# EAGLE design integrated (EAGLE 7.4.0)
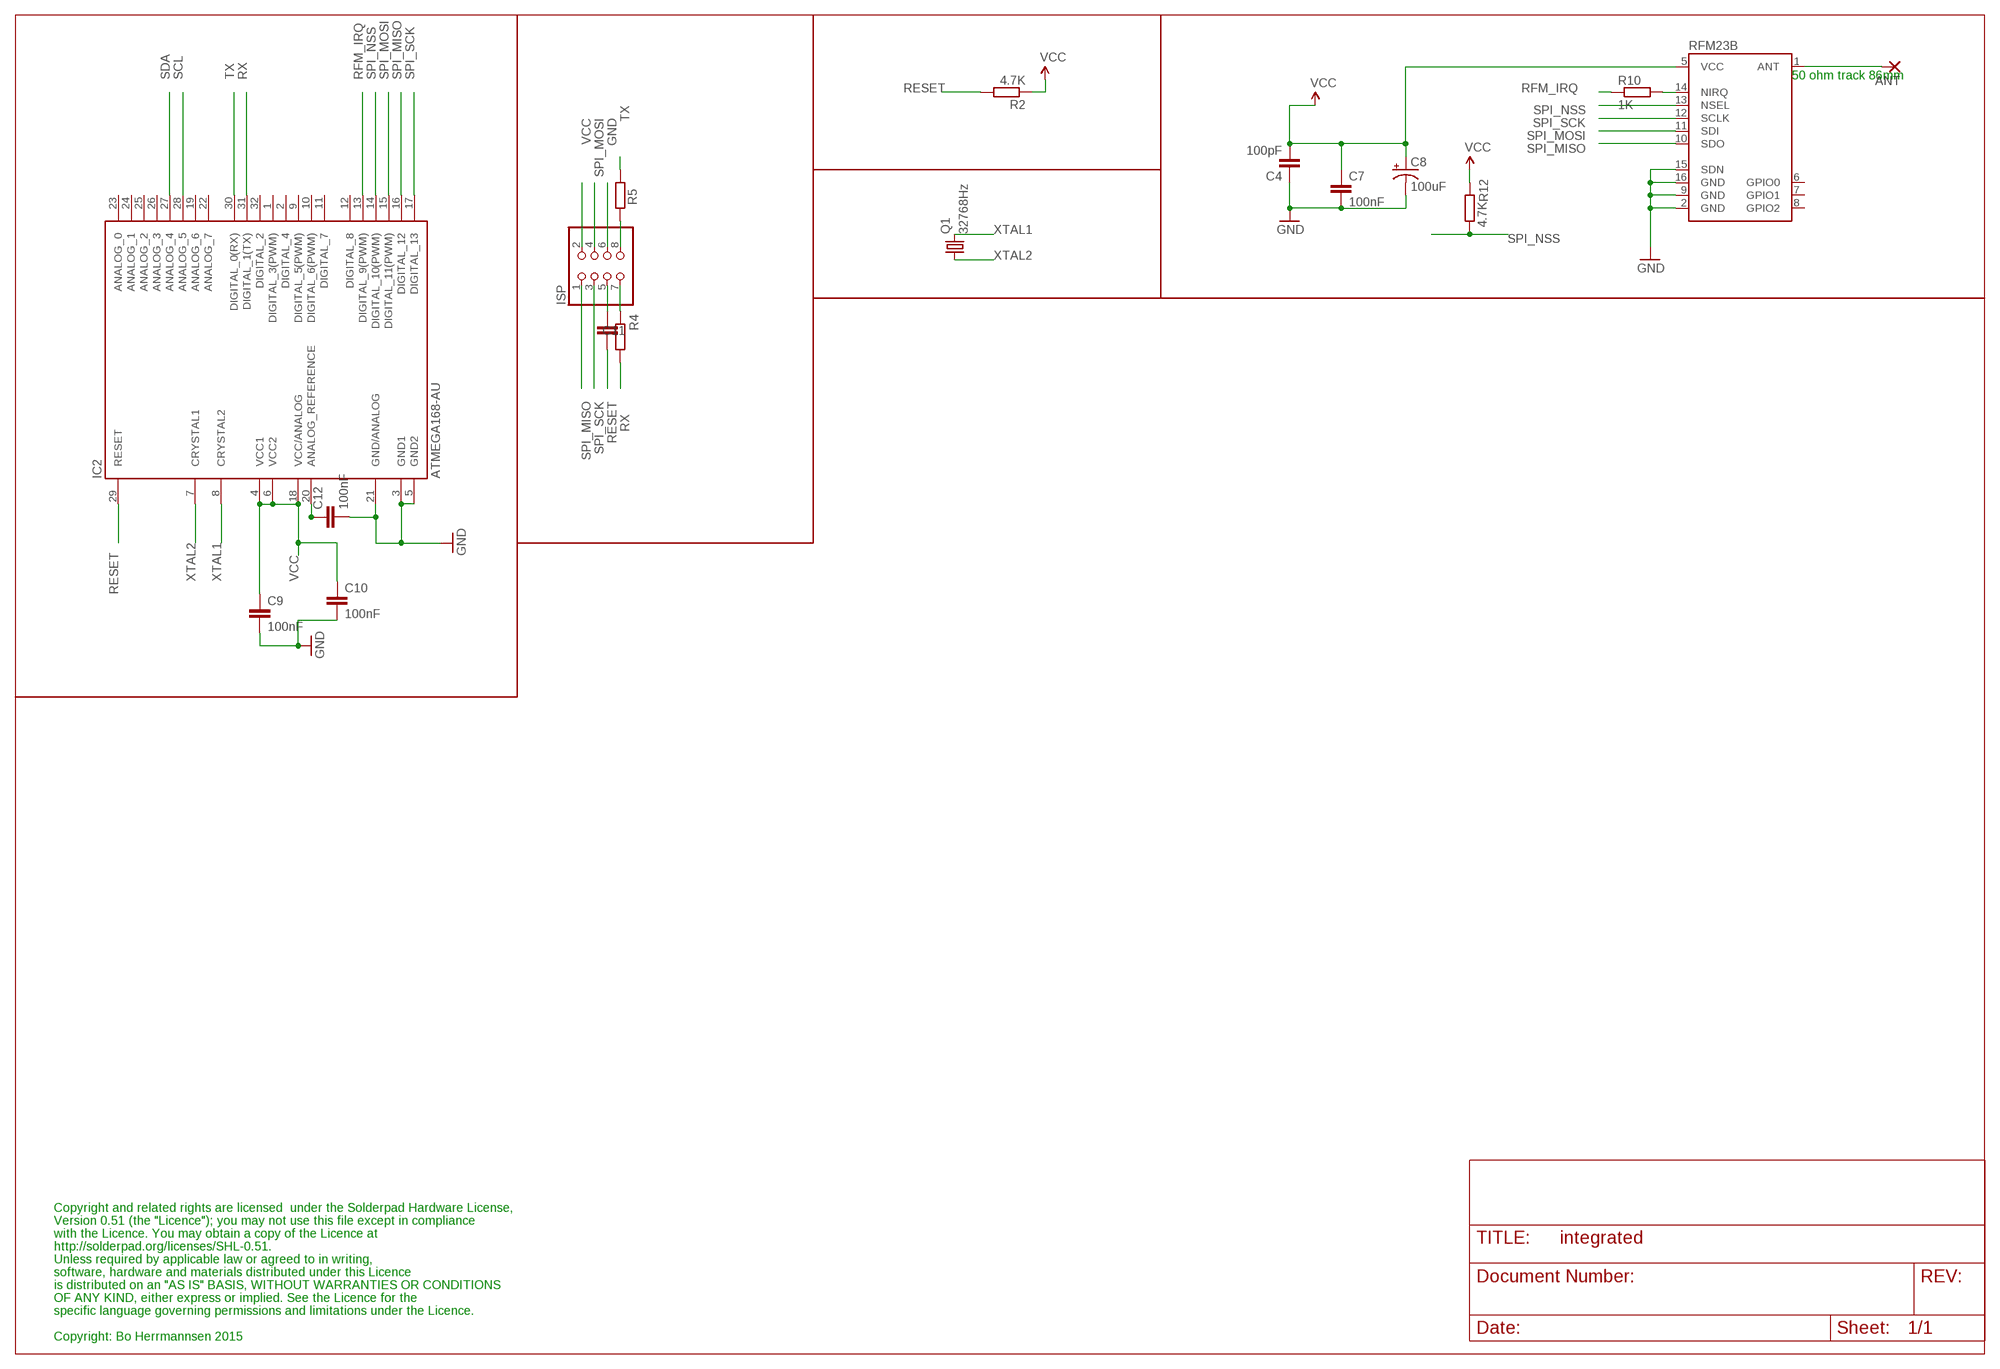
[diagram p0: schematic, sheet 1]

## Parts
ANT  2,15/1,0  [2,15/1,0]
C4  100pF  C-EUC0603  [C0603]
C7  100nF  C-EUC0603  [C0603]
C8  100uF  CAP_POL1206  [EIA3216]
C9  100nF  C-EUC0603  [C0603]
C10  100nF  C-EUC0603  [C0603]
C11  100nF  C-EUC0603  [C0603]
C12  100nF  C-EUC0603  [C0603]
IC2  ATMEGA168-AU  [TQFP32-08]
ISP  PINHD-2X4/90  [2X04/90]
Q1  32768Hz  MC-306  [MC-306]
R2  4.7K  R-EU_R0603  [R0603]
R4  4.7K  R-EU_R0603  [R0603]
R5  4.7K  R-EU_R0603  [R0603]
R10  1K  R-EU_R0603  [R0603]
R12  4.7K  R-EU_R0603  [R0603]
RFM23B  RFM23B  [RFM23-XXX-S1]

## Nets
GND [supply]: C4.1 C7.2 C8.C(-) C9.2 C10.2 C12.2 IC2.3(GND1) IC2.5(GND2) IC2.21(GND/ANALOG) ISP.6 RFM23B.2(GND) RFM23B.9(GND) RFM23B.15(SDN) RFM23B.16(GND)
N$1: C11.2 ISP.5
N$3: ISP.8 R5.2
N$4: ISP.7 R4.2
N$6 [supply]: C12.1 IC2.20(ANALOG_REFERENCE)
N$7: R10.2 RFM23B.14(NIRQ)
N$31 [ant]: ANT.1(P) RFM23B.1(ANT)
RESET: C11.1 IC2.29(RESET) R2.2
RFM_IRQ: IC2.13(DIGITAL_9(PWM)) R10.1
RX: IC2.31(DIGITAL_1(TX)) R4.1
SCL: IC2.28(ANALOG_5)
SDA: IC2.27(ANALOG_4)
SPI_MISO: IC2.16(DIGITAL_12) ISP.1 RFM23B.10(SDO)
SPI_MOSI: IC2.15(DIGITAL_11(PWM)) ISP.4 RFM23B.11(SDI)
SPI_NSS: IC2.14(DIGITAL_10(PWM)) R12.1 RFM23B.13(NSEL)
SPI_SCK: IC2.17(DIGITAL_13) ISP.3 RFM23B.12(SCLK)
TX: IC2.30(DIGITAL_0(RX)) R5.1
VCC [supply]: C4.2 C7.1 C8.A(+) C9.1 C10.1 IC2.4(VCC1) IC2.6(VCC2) IC2.18(VCC/ANALOG) ISP.2 R2.1 R12.2 RFM23B.5(VCC)
XTAL1: IC2.8(CRYSTAL2) Q1.4
XTAL2: IC2.7(CRYSTAL1) Q1.1
Unconnected: IC2.1(DIGITAL_3(PWM)) IC2.2(DIGITAL_4) IC2.9(DIGITAL_5(PWM)) IC2.10(DIGITAL_6(PWM)) IC2.11(DIGITAL_7) IC2.12(DIGITAL_8) IC2.19(ANALOG_6) IC2.22(ANALOG_7) IC2.23(ANALOG_0) IC2.24(ANALOG_1) IC2.25(ANALOG_2) IC2.26(ANALOG_3) IC2.32(DIGITAL_2) RFM23B.6(GPIO0) RFM23B.7(GPIO1) RFM23B.8(GPIO2)

## Notes on the sheet
- 50 ohm track 86mm
- Copyright and related rights are licensed  under the Solderpad Hardware License,
- Version 0.51 (the "Licence"); you may not use this file except in compliance
- with the Licence. You may obtain a copy of the Licence at
- http://solderpad.org/licenses/SHL-0.51.
- Unless required by applicable law or agreed to in writing,
- software, hardware and materials distributed under this Licence
- is distributed on an "AS IS" BASIS, WITHOUT WARRANTIES OR CONDITIONS
- OF ANY KIND, either express or implied. See the Licence for the
- specific language governing permissions and limitations under the Licence.
- Copyright: Bo Herrmannsen 2015

## Library data of the parts
ANT = wirepad:2,15/1,0: THROUGH-HOLE PAD
C4 C7 C9-C12 = resistor:C-EU: CAPACITOR, European symbol
C8 = SparkFun-Passives:CAP_POL: Capacitor Polarized These are standard SMD and PTH capacitors. Normally 10uF, 47uF, and 100uF in electrolytic and tantalum varieties. Always verify the external diameter of the through hole cap, it varies with capacity, voltage, and manufacturer. The EIA devices should be standard.
IC2 = Arduino-AVR:ATMEGA168
ISP = pinhead:PINHD-2X4: PIN HEADER
Q1 = crystal:MC-306: kHz RANGE CRYSTAL UNIT SMD Source: MC-306_405_406_E07X.PDF Homepage <http://www.epsontoyocom.co.jp>; MPN: MC-306 60.0KHZ 100PPM ,12.5PF; OC_FARNELL: 1278040; OC_NEWARK: 31M5576
R2 R4 R5 R10 R12 = resistor:R-EU_: RESISTOR, European symbol
RFM23B = SparkFun-RF:RFM23B

## Net classes
0 default: width 0.203 mm
1 supply: width 0.5 mm, clearance 0.203 mm
2 ant: width 2.184 mm

## Board
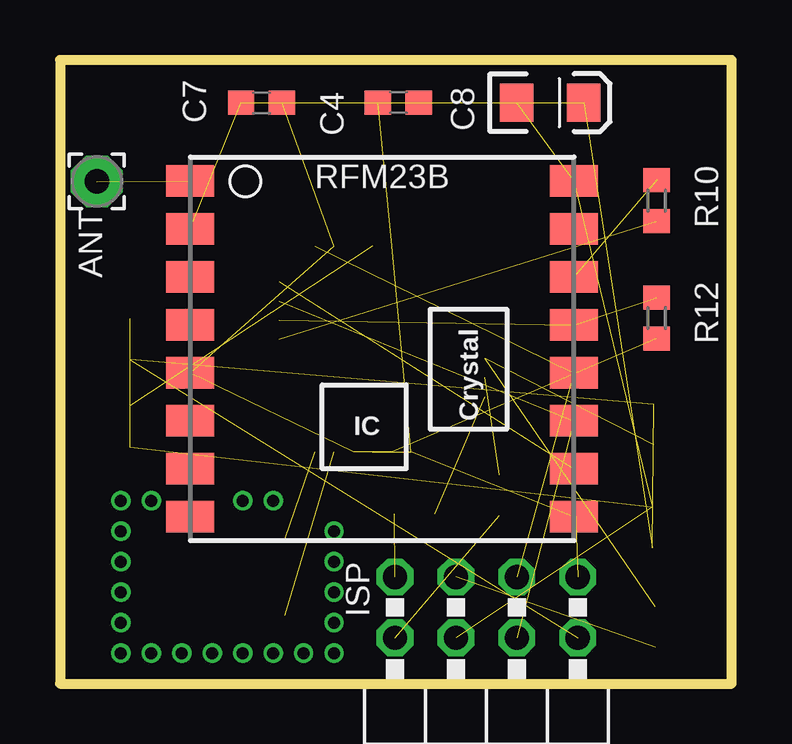
[diagram p1: board, top side]
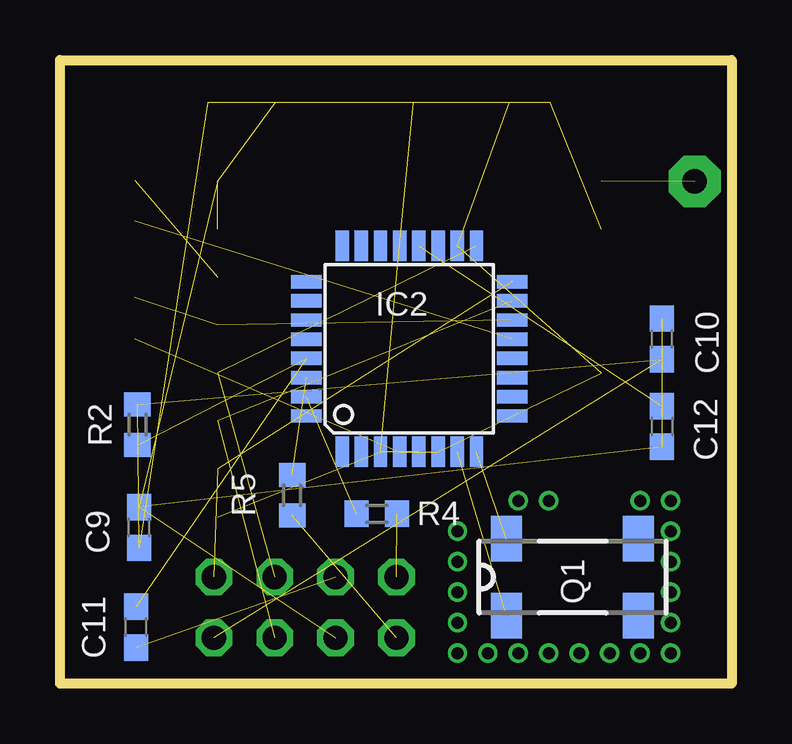
[diagram p2: board, bottom side, seen from below]

Size 28 x 26 mm. Coordinates in mm from the lower left corner, seen from the top.
Outline: 0,26 0,0 28,0 28,26 0,26
Copper layers (1*16): Top 0.035mm / dielectric 1.5mm / Bottom 0.035mm
Design rules "PMServicesStd *": minimum track width 8mil, minimum drill 0.5mm, track to track 8mil, track to pad 8mil, pad to pad 8mil, via to via 8mil, smd to smd 0mil, copper to edge 10mil, drill to drill 10mil, minimum pad ring 10mil, minimum via ring 6mil, stop-mask expansion 2mil, vias tented up to drill 100mil, thermal gap 10mil
tRestrict: area 2.5,1.3 to 7.6,7.6
bRestrict: area 2.5,1.3 to 7.6,7.6

### Footprints (pad centres in the part's own frame; a part is rotated, then mirrored left to right if it is on the bottom)
2,15/1,0 = drill 1.016 pad 2.159 octagon: 1 0,0
C0603 = smd 1.1 x 1: 1 -0.85,0; 2 0.85,0
EIA3216 = smd 1.4 x 1.6: A 1.4,0; C -1.4,0
TQFP32-08 = smd 1.27 x 0.559: 1 -4.293,2.8; 2 -4.293,2; 3 -4.293,1.2; 4 -4.293,0.4; 5 -4.293,-0.4; 6 -4.293,-1.2; 7 -4.293,-2; 8 -4.293,-2.8; 17 4.293,-2.8; 18 4.293,-2; 19 4.293,-1.2; 20 4.293,-0.4; 21 4.293,0.4; 22 4.293,1.2; 23 4.293,2; 24 4.293,2.8 | smd 0.559 x 1.27: 9 -2.8,-4.293; 10 -2,-4.293; 11 -1.2,-4.293; 12 -0.4,-4.293; 13 0.4,-4.293; 14 1.2,-4.293; 15 2,-4.293; 16 2.8,-4.293; 25 2.8,4.293; 26 2,4.293; 27 1.2,4.293; 28 0.4,4.293; 29 -0.4,4.293; 30 -1.2,4.293; 31 -2,4.293; 32 -2.8,4.293
2X04/90 = drill 1.016 octagon: 1 -3.81,-6.35; 2 -3.81,-3.81; 3 -1.27,-6.35; 4 -1.27,-3.81; 5 1.27,-6.35; 6 1.27,-3.81; 7 3.81,-6.35; 8 3.81,-3.81
MC-306 = smd 1.3 x 1.9: 1 -2.75,-1.6; 2 2.75,-1.6; 3 2.75,1.6; 4 -2.75,1.6
R0603 = smd 1 x 1.1: 1 -0.85,0; 2 0.85,0
RFM23-XXX-S1 = smd 2 x 1.3: 1 -8,7; 2 -8,5; 3 -8,3; 4 -8,1; 5 -8,-1; 6 -8,-3; 7 -8,-5; 8 -8,-7; 9 8,-7; 10 8,-5; 11 8,-3; 12 8,-1; 13 8,1; 14 8,3; 15 8,5; 16 8,7

### Placement (x,y rotation side)
ANT  1.53,20.93 90 top
C4  14.11,24.22 0 top
C7  8.4,24.22 180 top
C8  20.44,24.22 0 top
C9  24.7,6.51 90 bottom
C10  2.9,14.37 90 bottom
C11  24.83,2.35 270 bottom
C12  2.9,10.72 270 bottom
IC2  13.44,13.96 90 bottom
ISP  17.78,-1.91 180 top
Q1  6.63,4.44 0 bottom
R2  24.77,10.79 270 bottom
R4  14.79,7.08 0 bottom
R5  18.32,7.85 270 bottom
R10  24.88,20.13 90 top
R12  24.88,15.24 270 top
RFM23B  13.44,13.96 0 top

### Tracks (layer width: path | path; a pad name or v marks a point on that pad's centre or on a via)
GND  (13 unrouted)
N$1  (1 unrouted)
N$3  (1 unrouted)
N$4  (1 unrouted)
N$6  (1 unrouted)
N$7  (1 unrouted)
N$11  (via drill 0.5)
  other vias: 2.54,6.35
N$12  (via drill 0.5)
  other vias: 2.54,5.08
N$14  (via drill 0.5)
  other vias: 2.54,3.81
N$15  (via drill 0.5)
  other vias: 2.54,2.54
N$16  (via drill 0.5)
  other vias: 2.54,1.27
N$17  (via drill 0.5)
  other vias: 3.81,1.27
N$19  (via drill 0.5)
  other vias: 5.08,1.27
N$20  (via drill 0.5)
  other vias: 6.35,1.27
N$21  (via drill 0.5)
  other vias: 7.62,1.27
N$22  (via drill 0.5)
  other vias: 8.89,1.27
N$24  (via drill 0.5)
  other vias: 11.43,5.08
N$25  (via drill 0.5)
  other vias: 11.43,1.27
N$26  (via drill 0.5)
  other vias: 11.43,2.54 10.16,1.27
N$30  (via drill 0.5)
  other vias: 11.43,3.81
N$31  (1 unrouted)
N$33  (via drill 0.5)
  other vias: 8.89,7.62
N$34  (via drill 0.5)
  other vias: 7.62,7.62
N$37  (via drill 0.5)
  other vias: 3.81,7.62
N$38  (via drill 0.5)
  other vias: 2.54,7.62
N$39  (via drill 0.5)
  other vias: 11.43,6.35
RESET  (2 unrouted)
RFM_IRQ  (1 unrouted)
RX  (1 unrouted)
SPI_MISO  (2 unrouted)
SPI_MOSI  (2 unrouted)
SPI_NSS  (2 unrouted)
SPI_SCK  (2 unrouted)
TX  (1 unrouted)
VCC  (11 unrouted)
XTAL1  (1 unrouted)
XTAL2  (1 unrouted)